# EasyEDA Pro project ESP32-C3-PICO开发板.eprj, schematic Schematic1_12
Create Date: 2023-09-09; Page Name: P1; Project Name: ESP32-C3-PICO; Schematic Name: Schematic1_12; Update Date: 2023-09-09; Company: 嘉立创EDA; Page Size: A4; Version: V1.0
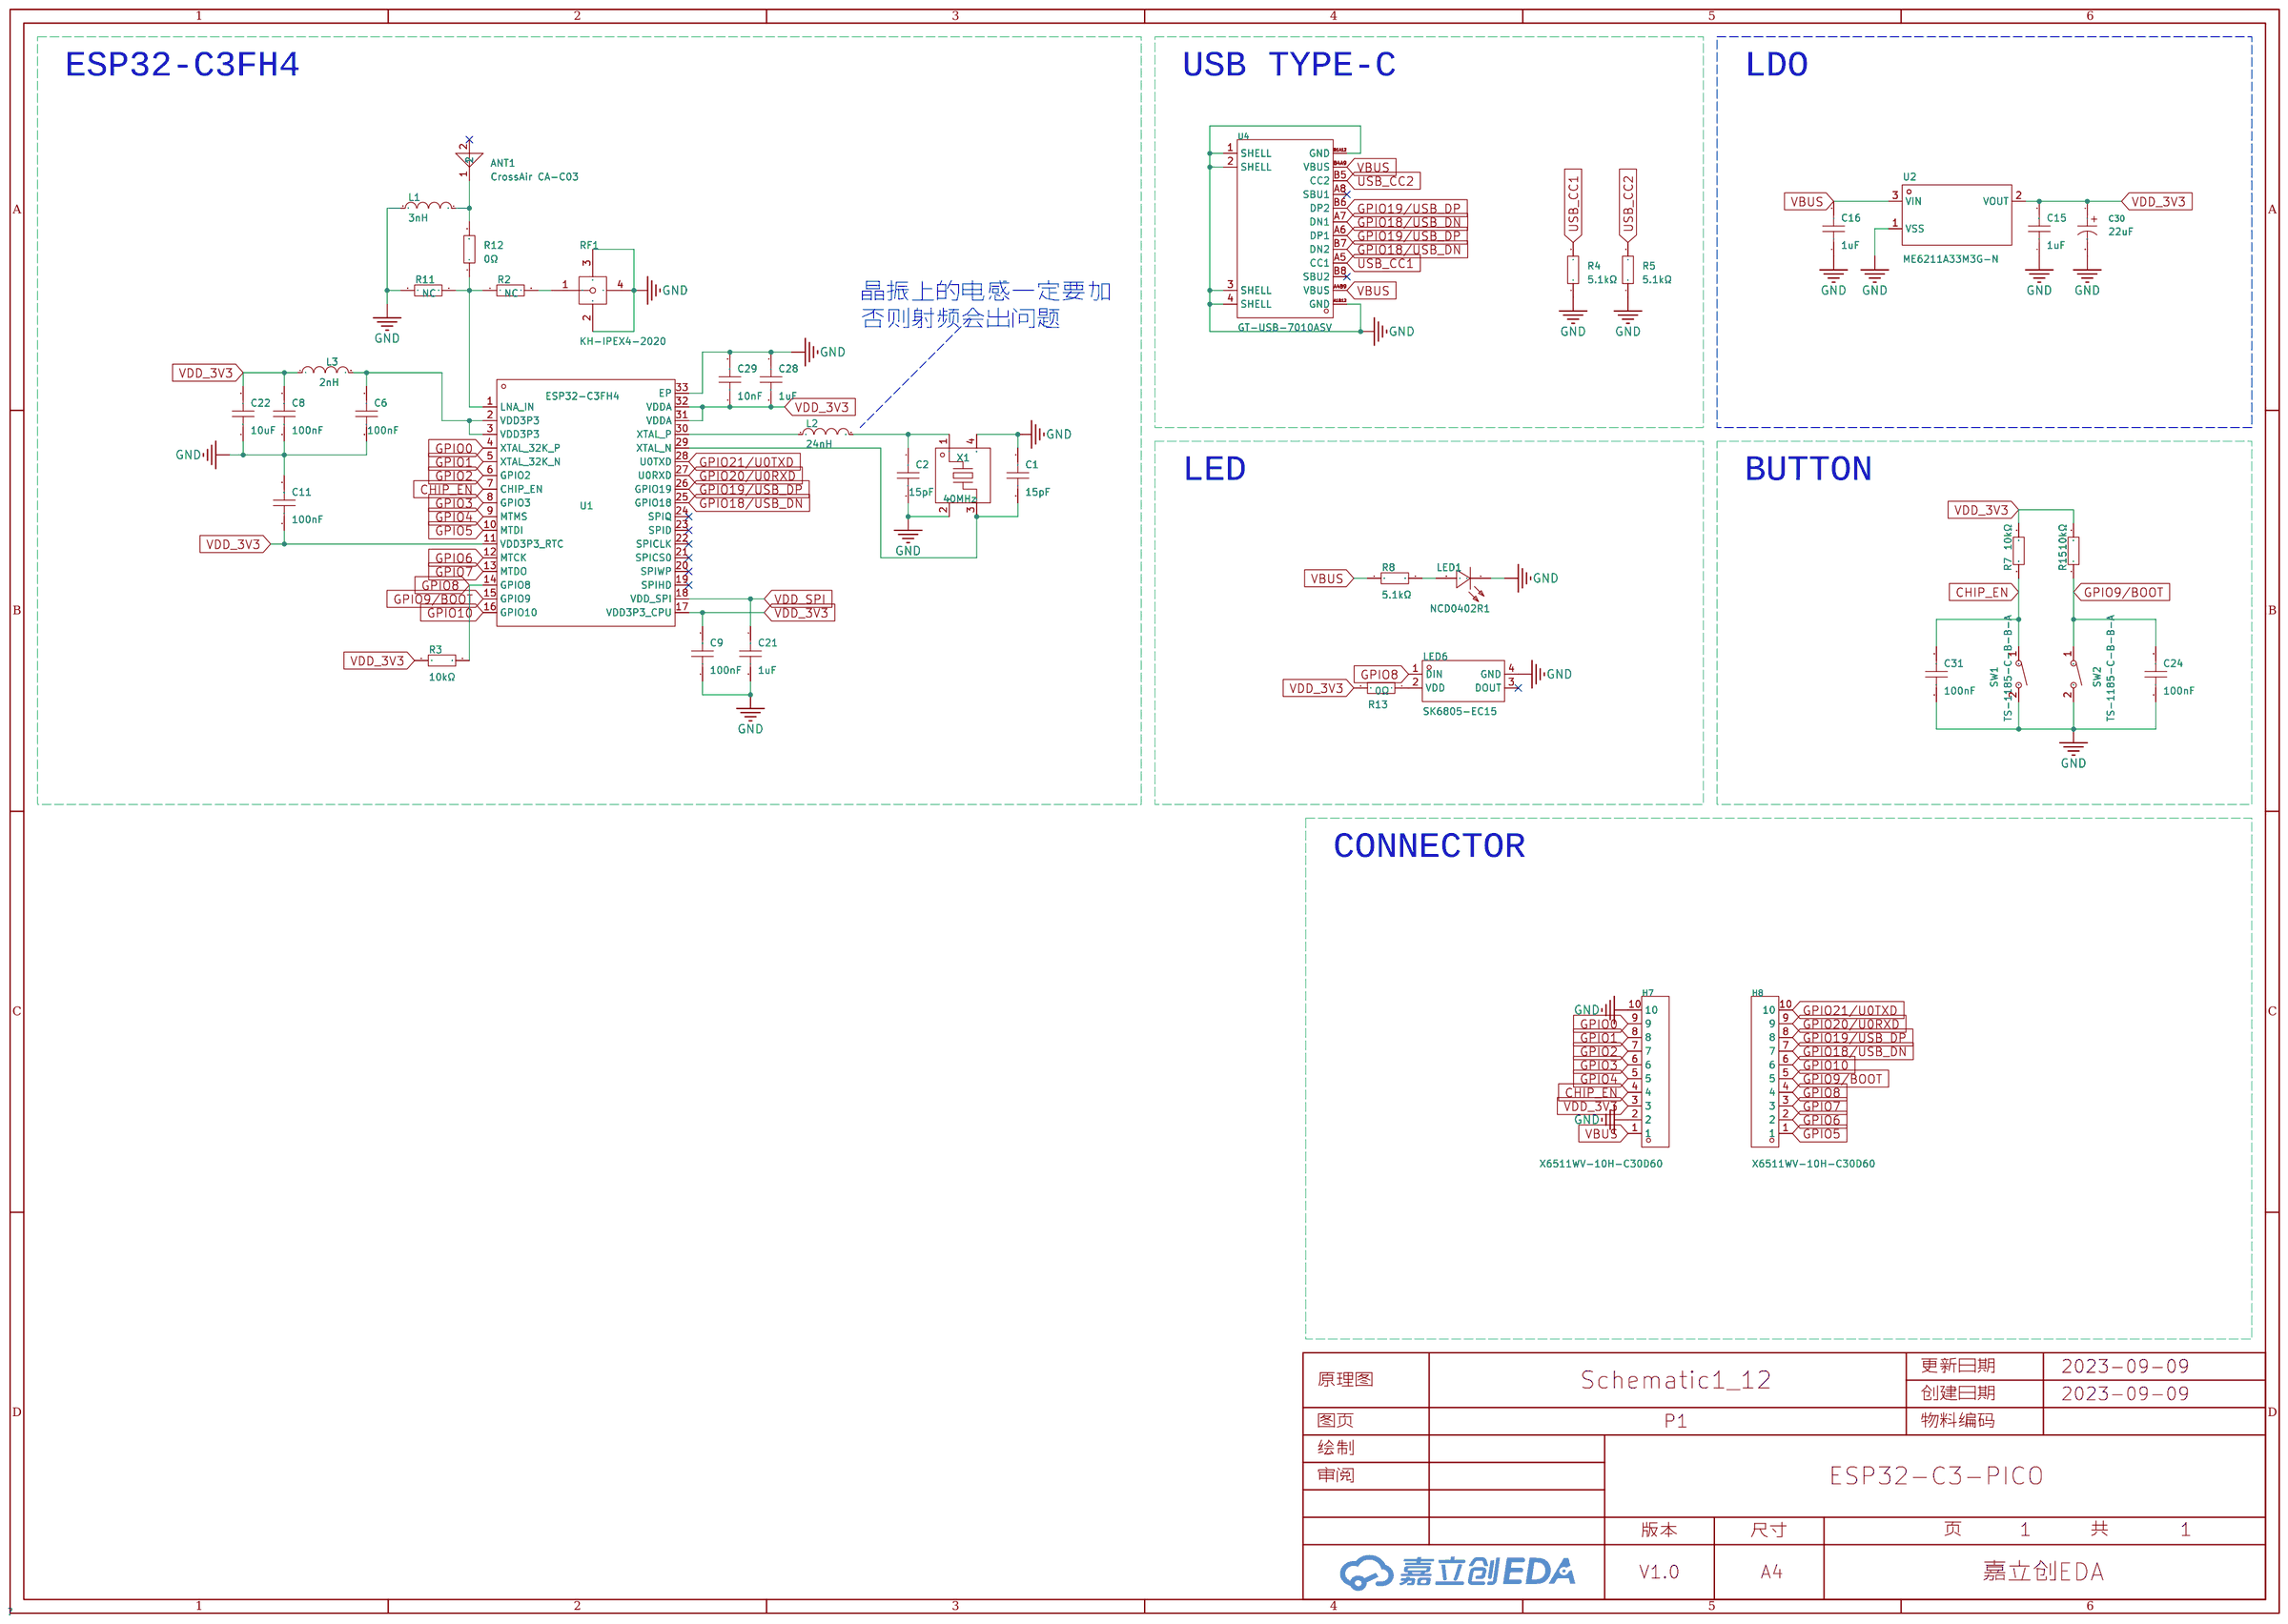
[diagram p2: schematic sheet]

## Parts
ANT1  CrossAir CA-C03  [ANT-SMD_CA-C03]
C1  15pF  [C0201]
C2  15pF  [C0201]
C6  100nF  [C0201]
C8  100nF  [C0201]
C9  100nF  [C0201]
C11  100nF  [C0201]
C15  1uF  [C0402MINI]
C16  1uF  [C0402MINI]
C21  1uF  [C0201]
C22  10uF  [C0402MINI]
C24  100nF  [C0201]
C28  1uF  [C0201]
C29  10nF  [C0201]
C30  22uF  [CAP-SMD_L2.0-W1.3-FD]
C31  100nF  [C0201]
H7  X6511WV-10H-C30D60  [HDR-TH_10P-P2.54-V-M]
H8  X6511WV-10H-C30D60  [HDR-TH_10P-P2.54-V-M]
L1  3nH  [L0201]
L2  24nH  [L0201]
L3  2nH  [L0201-RD]
LED1  NCD0402R1  [LED0402MINI]
LED6  SK6805-EC15  [LED-SMD_4P-L1.5-W1.5-BL]
R2  NC  [R0201]  (no BOM)
R3  10kΩ  [R0201]
R4  5.1kΩ  [R0201]
R5  5.1kΩ  [R0201]
R7  10kΩ  [R0201]
R8  5.1kΩ  [R0201]
R11  NC  [R0201]  (no BOM)
R12  0Ω  [R0201]
R13  0Ω  [R0201]
R15  10kΩ  [R0201]
RF1  KH-IPEX4-2020  [IPEX4-SMD_4P-L1.8-W1.7-LS2.0-L_KH-IPEX4-2020]
SW1  TS-1185-C-B-B-A  [SW-SMD_L4.0-W2.9-LS5.0]
SW2  TS-1185-C-B-B-A  [SW-SMD_L4.0-W2.9-LS5.0]
U1  ESP32-C3FH4  [QFN-32_L5.0-W5.0-P0.50-TL-EP3.7]
U2  ME6211A33M3G-N  [SOT-23-3_L2.9-W1.6-P1.90-LS2.8-BR]
U4  GT-USB-7010ASV  [USB-C-SMD_G-SWITCH_GT-USB-7010ASV]
X1  40MHz  [CRYSTAL-SMD_4P-L2.0-W1.6-BL]

## Library data of the parts
ANT1 = CrossAir CA-C03
C1 C2 = GRM0335C1H150FA01D: 容值:15pF;精度:±1%;额定电压:50V;材质(温度系数):C0G;; LCSC Part Name: 15pF ±1% 50V; Supplier Part: C237567; Manufacturer: muRata(村田); Supplier Footprint: 0201; JLCPCB Part Class: Extended Part; Datasheet: https://atta.szlcsc.com/upload/public/pdf/source/20190415/C237567_28BDE19A6D5FCDC5F5E36ABAB8C70B61.pdf; Supplier: LCSC; Tolerance: ±1%; Voltage Rated: 50V; Temperature Coefficient: C0G
C6 C8 C9 C11 C24 C31 = GRM033Z71A104KE14D: 容值:100nF;精度:±10%;额定电压:10V;材质(温度系数):X7R;; LCSC Part Name: 100nF ±10% 10V; Supplier Part: C161494; Manufacturer: muRata(村田); Supplier Footprint: 0201; JLCPCB Part Class: Extended Part; Datasheet: https://atta.szlcsc.com/upload/public/pdf/source/20181119/C161494_7C14CD1E604AF2690E90D16E0278156D.pdf; Supplier: LCSC; Tolerance: ±10%; Voltage Rated: 10V; Temperature Coefficient: X7R
C15 C16 = CL05A105KA5NQNC: 容值:1uF;精度:±10%;额定电压:25V;材质(温度系数):X5R;; LCSC Part Name: 1uF ±10% 25V; Supplier Part: C52923; Manufacturer: SAMSUNG(三星); Supplier Footprint: 0402; JLCPCB Part Class: Basic Part; Datasheet: https://atta.szlcsc.com/upload/public/pdf/source/20160103/1457707735223.pdf; Supplier: LCSC; Tolerance: ±10%; Voltage Rated: 25V; Temperature Coefficient: X5R; Check: true
C21 C28 = GRM033C81A105ME05D: 容值:1uF;精度:±20%;额定电压:10V;材质(温度系数):X6S;; LCSC Part Name: 1uF ±20% 10V; Supplier Part: C237278; Manufacturer: muRata(村田); Supplier Footprint: 0201; JLCPCB Part Class: Extended Part; Datasheet: https://atta.szlcsc.com/upload/public/pdf/source/20190513/C237278_F3358F26ECB1FE4E7B7A47CC66295717.pdf; Supplier: LCSC; Tolerance: ±20%; Voltage Rated: 10V; Temperature Coefficient: X6S
C22 = GRM155R61A106ME44D: 容值:10uF;精度:±20%;额定电压:10V;材质(温度系数):X5R;; LCSC Part Name: 10uF ±20% 10V; Supplier Part: C77000; Manufacturer: muRata(村田); Supplier Footprint: 0402; JLCPCB Part Class: Extended Part; Datasheet: https://atta.szlcsc.com/upload/public/pdf/source/20180530/C77000_4866797CFE3A842CD03C597EBD6AE6CD.pdf; Supplier: LCSC; Tolerance: ±20%; Voltage Rated: 10V; Temperature Coefficient: X5R; Check: true
C29 = 0201B103K250NT: 容值:10nF;精度:±10%;额定电压:25V;材质(温度系数):X7R;; LCSC Part Name: 10nF ±10% 25V; Supplier Part: C285010; Manufacturer: FH(风华); Supplier Footprint: 0201; JLCPCB Part Class: 扩展库; Datasheet: https://atta.szlcsc.com/upload/public/pdf/source/20180913/C285010_919D079411E4B74BC161EEA5068FF050.pdf; Supplier: LCSC; Tolerance: ±10%; Voltage Rated: 25V; Temperature Coefficient: X7R
C30 = TCTP1A226M8R: 容值:22uF;精度:±20%;额定电压:10V;等效串联电阻:5Ω;; LCSC Part Name: 22uF ±20% 10V; Supplier Part: C2859526; Manufacturer: ROHM(罗姆); Supplier Footprint: 0805; JLCPCB Part Class: 扩展库; Datasheet: https://atta.szlcsc.com/upload/public/pdf/source/20210811/7E78ACA5067F10A87746306F4D5F4D3B.pdf; Supplier: LCSC; Tolerance: ±20%; Rated Voltage: 10V; Equivalent Series Resistance(ESR): 5Ω; Operating Temperature: -55℃~+125℃
H7 H8 = X6511WV-10H-C30D60: 排数:单排;总PIN位数:10P;间距:2.54mm;插针结构:1x10P;行距:-;安装类型:直插;圆针/方针:方针;额定电流:3A;额定电压:250V;配合针长度:6mm;塑高:2.5mm;端接针长度:3mm;触头材质:黄铜;触头镀层:金;工作温度范围:-40℃~+105℃;焊接温度(最大值):260℃;颜色:黑色;; LCSC Part Name: 2.54mm 1x10P 直插 方针 镀金足1U; Supplier Part: C706882; Manufacturer: XKB Connectivity(中国星坤); Supplier Footprint: 插件,P=2.54mm; JLCPCB Part Class: 扩展库; Datasheet: https://atta.szlcsc.com/upload/public/pdf/source/20211009/D19569EFFEB9776B42364DF7D41FD96A.pdf; Supplier: LCSC; Number of Rows: 单排; Number of Pins: 10P; Pitch: 2.54mm; Pin Structure: 1x10P; Mounting Type: 直插; Circluar Pins/Square Pins: 方针; Current Rating (Max): 3A; Voltage Rating (Max): 250V; Length of Mating Pin: 6mm; Insulation Height: 2.5mm; Length of End Connection Pin: 3mm; Contact Material: 黄铜; Contact Plating: 金; Operating Temperature Range: -40℃~+105℃; Welding Temperature (Max): 260℃; Color: 黑色
L1 = LQP03TN3N0B02D: 电感值:3nH;额定电流:-;饱和电流(Isat):-;直流电阻(DCR):250mΩ;; LCSC Part Name: 3nH ±0.1nH; Supplier Part: C98044; Manufacturer: muRata(村田); Supplier Footprint: 0201; JLCPCB Part Class: Extended Part; Datasheet: https://atta.szlcsc.com/upload/public/pdf/source/20170310/1489116404591.pdf; Supplier: LCSC; DC Resistance (DCR): 250mΩ; Q @ Freq: 14@500MHz; Frequency - Self Resonant: 9.5GHz
L2 = LQP03TN24NH02D: 电感值:24nH;精度:±3%;额定电流:140mA;饱和电流(Isat):-;直流电阻(DCR):2.3Ω;; LCSC Part Name: 24nH ±3%; Supplier Part: C206441; Manufacturer: muRata(村田); Supplier Footprint: 0201; JLCPCB Part Class: Extended Part; Datasheet: https://atta.szlcsc.com/upload/public/pdf/source/20180629/C206441_29EEB8497CAEFB06D062E58140260038.pdf; Supplier: LCSC; Tolerance: ±3%; Rated Current: 140mA; DC Resistance (DCR): 2.3Ω; Q @ Freq: 12@500MHz; Frequency - Self Resonant: 2GHz
L3 = LQP03TN2N0B02D: 电感值:2nH;精度:-;额定电流:600mA;饱和电流(Isat):-;直流电阻(DCR):150mΩ;; LCSC Part Name: 2nH ±0.1nH; Supplier Part: C86125; Manufacturer: muRata(村田); Supplier Footprint: 0201; JLCPCB Part Class: 扩展库; Datasheet: https://atta.szlcsc.com/upload/public/pdf/source/20180327/C86125_B203EC36879A731F95A6EB7F537B05E7.pdf; Supplier: LCSC; Rated Current: 600mA; DC Resistance (DCR): 150mΩ; Q @ Freq: 14@500MHz; Frequency - Self Resonant: 12.5GHz
LED1 = NCD0402R1: 发光颜色:红灯;; LCSC Part Name: 红灯; Supplier Part: C130719; Manufacturer: 国星光电; Supplier Footprint: 0402; JLCPCB Part Class: Extended Part; Datasheet: https://atta.szlcsc.com/upload/public/pdf/source/20200820/C130719_A72EA5A7FEC83C35856EA0453E4EE775.pdf; Supplier: LCSC; Emitted Color: 红灯
LED6 = SK6805-EC15: 发光颜色:RGB三色;二极管配置:-;主波长:520nm~530nm；620nm~625nm；460nm~470nm;色温:-;功率:-;安装方式:-;; LCSC Part Name: RGB三色; Supplier Part: C2890035; Manufacturer: 欧思科光电; Supplier Footprint: 0606; JLCPCB Part Class: 扩展库; Datasheet: https://atta.szlcsc.com/upload/public/pdf/source/20210825/EBA988D9EF3F04A47033350D5CF2A1E1.pdf; Supplier: LCSC; Emitted Color: RGB三色; Dominant Wavelength: 520nm~530nm；620nm~625nm；460nm~470nm; Forward Current: 3mA; Operating Temperature: -40℃~+80℃
R2 R11-R13 = RC0201JR-070RL: 温度系数:-;工作温度范围:-55℃~+155℃;电阻长:-;精度:±5%;电阻直径:-;电阻高:-;电阻宽:-;最大工作电压:25V;电阻类型:厚膜电阻;阻值:0Ω;功率:50mW;; LCSC Part Name: 0Ω ±5%; Supplier Part: C106228; Manufacturer: YAGEO(国巨); Supplier Footprint: 0201; JLCPCB Part Class: Extended Part; Datasheet: https://atta.szlcsc.com/upload/public/pdf/source/20170912/C106228_1505207468789963235.pdf; Supplier: LCSC; Operating Temperature Range: -55℃~+155℃; Tolerance: ±5%; Overload Voltage (Max): 25V; Type: 厚膜电阻; Power(Watts): 50mW
R3 R7 R15 = RC0201FR-0710KL: 电阻类型:厚膜电阻;阻值:10kΩ;精度:±1%;功率:50mW;; LCSC Part Name: 10kΩ ±1% 50mW; Supplier Part: C106225; Manufacturer: YAGEO(国巨); Supplier Footprint: 0201; JLCPCB Part Class: Extended Part; Datasheet: https://atta.szlcsc.com/upload/public/pdf/source/20171221/C106225_15138309973201195185.pdf; Supplier: LCSC; Type: 厚膜电阻; Tolerance: ±1%; Power(Watts): 50mW; Temperature Coefficient: ±200ppm/℃; Overload Voltage (Max): 25V; Operating Temperature Range: -55℃~+125℃
R4 R5 R8 = RC-01W5101FT: 阻值:5.1kΩ;精度:±1%;功率:50mW;; LCSC Part Name: 5.1kΩ ±1% 50mW; Supplier Part: C320937; Manufacturer: FH(风华); Supplier Footprint: 0201; JLCPCB Part Class: Extended Part; Datasheet: https://atta.szlcsc.com/upload/public/pdf/source/20181120/C320937_0D7162DF20EC676B2B67CC3D469B426E.pdf; Supplier: LCSC; Tolerance: ±1%; Power(Watts): 50mW; Temperature Coefficient: ±200ppm/℃; Overload Voltage (Max): 25V; Operating Temperature Range: -55℃~+125℃
RF1 = KH-IPEX4-2020: 连接器类型:板端;射频系列:IPEX;接口类型:内针;端口数量:1;阻抗:50Ω;频率-最大值:3GHz;样式:-;接口直径:1.5mm;接口长度/高度:-;工作温度范围:-40℃~+90℃;; LCSC Part Name: IPEX 内针 4代; Supplier Part: C530666; Manufacturer: kinghelm(金航标); Supplier Footprint: SMD; JLCPCB Part Class: Extended Part; Datasheet: https://atta.szlcsc.com/upload/public/pdf/source/20200512/C530666_73AD8E68D965007C672E9CE817423592.pdf; Supplier: LCSC; Connector Type: 板端; RF Series: IPEX; Interface Type: 内针; Number of Ports: 1; Impedance: 50Ω; Frequency-Max: 3GHz; Interface Diameter: 1.5mm; Operating Temperature Range: -40℃~+90℃
SW1 SW2 = TS-1185-C-B-B-A: 触点电流:50mA;额定电压(DC):12V;绝缘电阻:-;电路结构:单刀单掷;安装方式:立贴;带灯:无;作用力:260gf;机械寿命:10万次;带支架:否;; LCSC Part Name: 立贴 4*3*2.5mm 轻触开关; Supplier Part: C561523; Manufacturer: XKB Connectivity(中国星坤); Supplier Footprint: SMD; JLCPCB Part Class: 扩展库; Datasheet: https://atta.szlcsc.com/upload/public/pdf/source/20211011/C2F26DC0AE1820400F54DBF49644F5A1.pdf; Supplier: LCSC; Contact Current: 50mA; Voltage Rating (DC): 12V; Circuit: 单刀单掷; Mounting Style: 立贴; Actuator Style: 圆形按钮; Actuator/Cap Color: 黑色; With Lamp: 无; Operating Force: 260gf; Mechanical Life: 10万次; Operating Temperature: -30℃~+85℃; Switch Length: 4mm; Switch Width: 3mm; Switch Height: 2.5mm; Strike Gundam: 否
U1 = ESP32-C3FH4: Supplier Part: C2858491; Manufacturer: ESPRESSIF(乐鑫); Supplier Footprint: QFN-32; JLCPCB Part Class: Extended Part; Datasheet: https://atta.szlcsc.com/upload/public/pdf/source/20210726/B8823F05EB5B1ECA99D4F01661A43FA8.pdf; Supplier: LCSC
U2 = ME6211A33M3G-N: 输出类型:固定;输出极性:正;最大输入电压:6V;输出电压:3.3V;输出电流:500mA;电源纹波抑制比(PSRR):70dB;; LCSC Part Name: 正 Vin=6V Vout=3.3V 500mA 70dB; Supplier Part: C168807; Manufacturer: MICRONE(南京微盟); Supplier Footprint: SOT-23; JLCPCB Part Class: 扩展库; Datasheet: https://atta.szlcsc.com/upload/public/pdf/source/20180224/C168807_15194366627921363679.pdf; Supplier: LCSC; Output Type: 固定; Output Polarity: 正; Number of Outputs: 1; Maximum Input Voltage: 6V; Output Voltage: 3.3V; Dropout Voltage: 260mV@(200mA); Output Current: 500mA; Power Supply Rejection Ratio (PSRR): 70dB
U4 = GT-USB-7010ASV: Supplier Part: C2988369; Manufacturer: G-Switch(品赞); Supplier Footprint: SMD; JLCPCB Part Class: 扩展库; Supplier: LCSC
X1 = 7D040000I01: 频率:40MHz;频率公差:±10ppm;频率稳定度:±20ppm;负载电容:10pF;; LCSC Part Name: 40MHz ±10ppm 内置负载电容:10pF; Supplier Part: C648973; Manufacturer: HD(浩都频率); Supplier Footprint: SMD2016-4P; JLCPCB Part Class: 扩展库; Datasheet: https://atta.szlcsc.com/upload/public/pdf/source/20220223/118C2648083ADD7FA58C5549E27EC941.pdf; Supplier: LCSC; Crystal Type: 贴片无源晶振; Frequency Tolerance: ±10ppm; Frequency Stability: ±20ppm; Load Capacitance: 10pF

## Nets
GND: C1.1 C2.2 C6.2 C8.2 C9.1 C11.2 C15.1 C16.1 C21.2 C22.1 C24.1 C28.1 C29.2 C30.2 C31.2 H7.2 H7.10 L1.2 LED1.1(K) LED6.4(GND) R4.1 R5.1 R11.2 RF1.2 RF1.3 RF1.4 SW1.2 SW2.2 U1.33(EP) U2.1(VSS) U4.1(SHELL) U4.2(SHELL) U4.3(SHELL) U4.4(SHELL) U4.A1B12(GND) U4.B1A12(GND) X1.2(GND) X1.4(GND)
VBUS: C16.2 H7.1 R8.2 U2.3(VIN) U4.A4B9(VBUS) U4.B4A9(VBUS)
VDD_3V3: C8.1 C9.2 C11.1 C15.2 C22.2 C28.2 C29.1 C30.1 H7.3 L3.1 R3.2 R7.2 R13.2 R15.2 U1.11(VDD3P3_RTC) U1.17(VDD3P3_CPU) U1.31(VDDA) U1.32(VDDA) U2.2(VOUT)
VDD_SPI: C21.1 U1.18(VDD_SPI)
CHIP_EN: C31.1 H7.4 R7.1 SW1.1 U1.7(CHIP_EN)
GPIO0: H7.9 U1.4(XTAL_32K_P)
GPIO1: H7.8 U1.5(XTAL_32K_N)
GPIO2: H7.7 U1.6(GPIO2)
GPIO3: H7.6 U1.8(GPIO3)
GPIO4: H7.5 U1.9(MTMS)
GPIO5: H8.1 U1.10(MTDI)
GPIO6: H8.2 U1.12(MTCK)
GPIO7: H8.3 U1.13(MTDO)
GPIO8: H8.4 LED6.1(DIN) R3.1 U1.14(GPIO8)
GPIO9/BOOT: C24.2 H8.5 R15.1 SW2.1 U1.15(GPIO9)
GPIO10: H8.6 U1.16(GPIO10)
GPIO18/USB_DN: H8.7 U1.25(GPIO18) U4.A7(DN1) U4.B7(DN2)
GPIO19/USB_DP: H8.8 U1.26(GPIO19) U4.A6(DP1) U4.B6(DP2)
GPIO20/U0RXD: H8.9 U1.27(U0RXD)
GPIO21/U0TXD: H8.10 U1.28(U0TXD)
USB_CC1: R4.2 U4.A5(CC1)
USB_CC2: R5.2 U4.B5(CC2)
$1N537: C1.2 U1.29(XTAL_N) X1.3
$1N9429: LED1.2(A) R8.1
$1N59078: C2.1 L2.2 X1.1
$1N59083: L2.1 U1.30(XTAL_P)
$1N70790: R2.2 RF1.1
$1N70798: R2.1 R11.1 R12.1 U1.1(LNA_IN)
$1N70816: ANT1.1 L1.1 R12.2
$1N70868: C6.1 L3.2 U1.2(VDD3P3) U1.3(VDD3P3)
$1N74389: LED6.2(VDD) R13.1

Not connected (* = marked no-connect by the designer): ANT1 2*; LED6 3(DOUT)*; U1 19(SPIHD)* 20(SPIWP)* 21(SPICS0)* 22(SPICLK)* 23(SPID)* 24(SPIQ)*; U4 A8(SBU1)* B8(SBU2)*

## Notes on the sheet
- ESP32-C3FH4
- USB TYPE-C
- LDO
- 晶振上的电感一定要加
  否则射频会出问题
- LED
- BUTTON
- CONNECTOR
